# Altium schematic sheet WireLessPhone_PhotoNFC.SchDoc
size 420 x 297 mm; DocumentNumber: ФНКЦ.542321.001 Э3; SheetNumber: 5; Format: A3
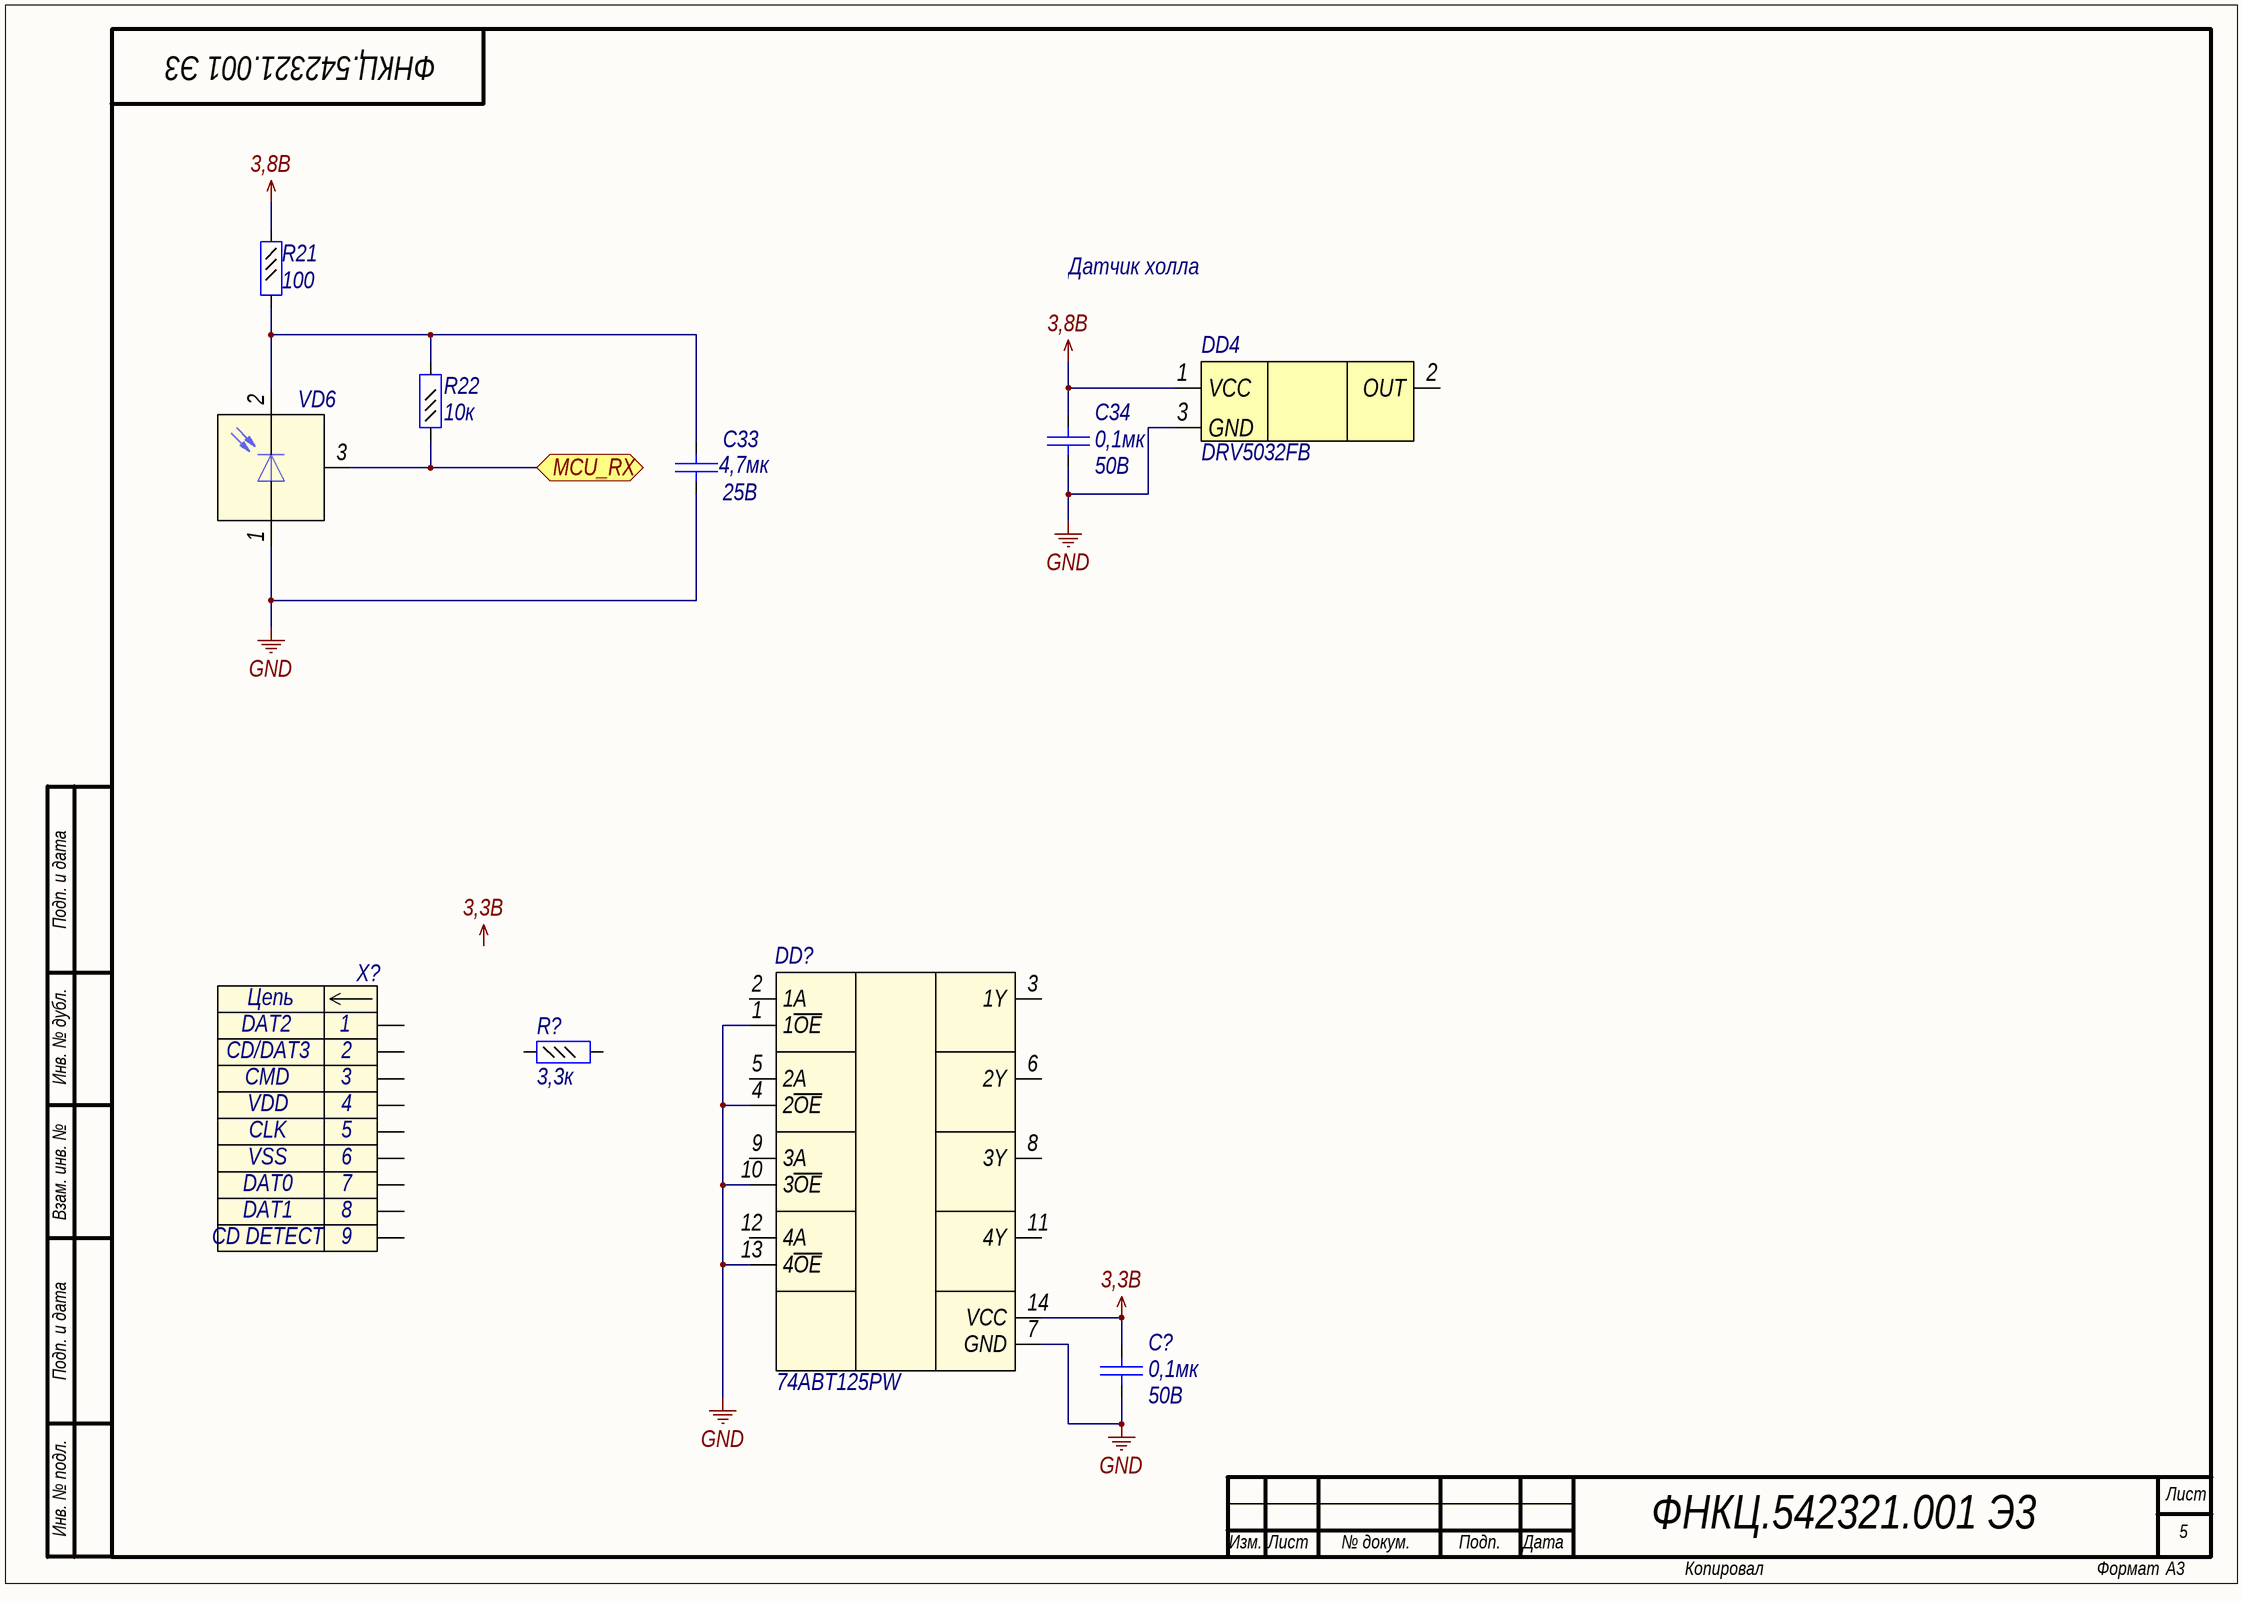
[diagram p0: WireLessPhone_PhotoNFC.SchDoc]

## Parts
C33  value 4,7мк  Voltage: 25B  [C0805]  (hidden comment: Capacitor)
C34  value 0,1мк  Voltage: 50B  [C0603]  (hidden comment: Capacitor)
C?  value 0,1мк  Voltage: 50B  [C0603]  (hidden comment: Capacitor)
DD4  Part Number: DRV5032FB  [SOT23-3]  (hidden comment: DRV5032)
DD?  Part Number: 74ABT125PW  [TSSOP14]  (hidden comment: 74ABT125)
R21  value 100  [R0603]  (hidden comment: Resistor_0,062Вт)
R22  value 10к  [R0603]  (hidden comment: Resistor_0,062Вт)
R?  value 3,3к  [R0603]  (hidden comment: Resistor_0,062Вт)
VD6  IR_LED  [TVCAST]  (value not drawn)
X?  MICROSD-SDIO  [MICROSD]  (value not drawn)

## Ports
MCU_RX

## Nets
3,3B: C?.2 DD?.14(VCC)
3,8B: C34.2 DD4.1(VCC) R21.1
GND: C33.1 C34.1 C?.1 DD4.3(GND) DD?.1(1~{OE}) DD?.4(2~{OE}) DD?.7(GND) DD?.10(3~{OE}) DD?.13(4~{OE}) VD6.1(GND)
MCU_RX: R22.1 VD6.3(OUT) ; port MCU_RX
NetC33_2: C33.2 R21.2 R22.2 VD6.2(VCC)

Not connected (* = marked no-connect by the designer): DD4 2(OUT); DD? 2(1A) 3(1Y) 5(2A) 6(2Y) 8(3Y) 9(3A) 11(4Y) 12(4A); R? 1 2; X? 1 2 3 4 5 6 7 8 9

## Notes on the sheet
- Датчик холла
- Подп. и дата
- Инв. № дубл.
- Взам. инв. №
- Инв. № подл.
- Лист
- Изм.
- № докум.
- Подп.
- Дата
- Копировал
- Формат
- Labels drawn without touching a wire or pin: 3,3B
- (in symbol connect43) Цепь; CD DETECT

## Library data of the parts
C33 = cap154: Конденсатор; Part Name: Ceramic; Manufacture: Murata; Part Number: GRM21BR61E475KA12L; id: cap154; TKE: X5R
C34 C? = cap131: Конденсатор; Part Name: Ceramic; Manufacture: Murata; Part Number: GRM188R71H104K; id: cap131; TKE: X7R
DD4 = DRV5032FB: Датчик Холла с рекордно низким потреблением; Part Name: Hall sensor; Manufacture: Texas Instruments; id: hall2; Magnetic threshold: 4,8mT; MAGNETIC RESPONSE: Omnipolar; OUTPUT TYPE: Push-pull; SAMPLING RATE: 5 Hz; Power Supply: 1,65B...5,5B
DD? = logic8: CMOS Bilateral Analog Switch; Part Name: Quad buffer; Manufacture: Nexperia; id: logic8; Number of elements: 4; Logic High Level: 2B; Logic Low Level: 0,8B; Power Supply: 4,5В-5,5B; Type of Logic: CMOS
R21 = res435: Резистор; Manufacture: Yageo; Part Number: RC0603FR-07100RL; id: res435; Accuracy: 1%; Part Name: Resistor; Power: 0,062Вт
R22 = res483: Резистор; Manufacture: Yageo; Part Number: RC0603FR-0710KL; id: res483; Accuracy: 1%; Part Name: Resistor; Power: 0,062Вт
R? = res471: Резистор; Manufacture: Yageo; Part Number: RC0603FR-072K3; id: res471; Accuracy: 1%; Part Name: Resistor; Power: 0,062Вт
VD6 = diode26: Светодиод; Part Name: IR Receiver Modules; Part Number: TSOP39238; Manufacture: Vishay; Supply Voltage: 2,5-5,5B; Carrier Frequency: 38kHz; Transmission Distance: 30m; Viewing Angle: (+-)45; Detection Treshold: 0.08; id: diode26
X? = connect43: Contact_1: DAT2; Contact_2: CD/DAT3; Contact_3: CMD; Contact_4: VDD; Contact_5: CLK; Contact_6: VSS; Contact_7: DAT0; Contact_8: DAT1; Part Name: MICRO SD-SDIO; id: connect43